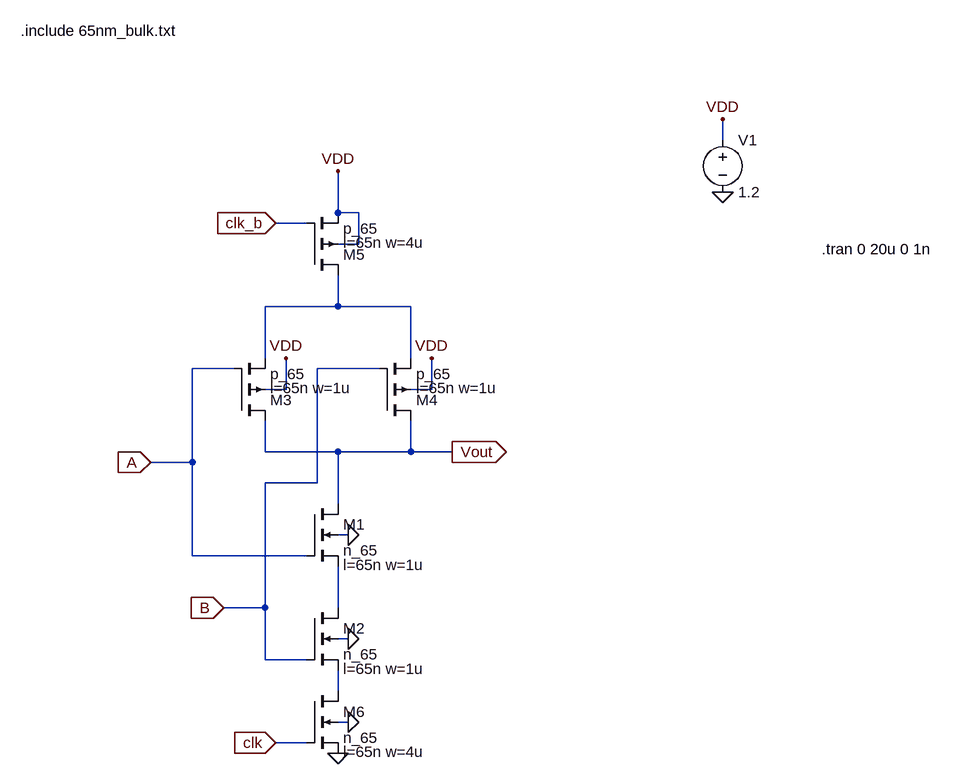
[diagram p0: schematic nand_sym.asc]
nand_sym.asc, the LTspice schematic file:
Version 4
SHEET 1 1728 992
WIRE 592 -240 592 -272
WIRE 0 -128 0 -192
WIRE 32 -128 0 -128
WIRE -48 -112 -96 -112
WIRE 32 -80 32 -128
WIRE 32 -80 0 -80
WIRE 0 16 0 -32
WIRE 0 16 -112 16
WIRE 112 16 0 16
WIRE -112 96 -112 16
WIRE 112 96 112 16
WIRE -160 112 -224 112
WIRE 64 112 -32 112
WIRE -80 144 -80 96
WIRE -80 144 -112 144
WIRE 144 144 144 96
WIRE 144 144 112 144
WIRE -112 240 -112 192
WIRE 0 240 -112 240
WIRE 112 240 112 192
WIRE 112 240 0 240
WIRE 176 240 112 240
WIRE -224 256 -224 112
WIRE -224 256 -288 256
WIRE -32 288 -32 112
WIRE -32 288 -112 288
WIRE 0 320 0 240
WIRE 16 368 0 368
WIRE -224 400 -224 256
WIRE -48 400 -224 400
WIRE -112 480 -112 288
WIRE -112 480 -176 480
WIRE 0 480 0 416
WIRE 16 528 0 528
WIRE -112 560 -112 480
WIRE -48 560 -112 560
WIRE 0 608 0 576
WIRE 16 656 0 656
WIRE -48 688 -96 688
FLAG 0 -192 VDD
FLAG 16 368 0
FLAG 16 528 0
FLAG -288 256 A
IOPIN -288 256 In
FLAG -176 480 B
IOPIN -176 480 In
FLAG -80 96 VDD
FLAG 144 96 VDD
FLAG 16 656 0
FLAG 0 704 0
FLAG -96 -112 clk_b
IOPIN -96 -112 In
FLAG -96 688 clk
IOPIN -96 688 In
FLAG 176 240 Vout
IOPIN 176 240 Out
FLAG 592 -272 VDD
FLAG 592 -160 0
SYMBOL nmos4 -48 320 R0
WINDOW 123 56 94 Left 2
SYMATTR Value2 l=65n w=1u
SYMATTR InstName M1
SYMATTR Value n_65
SYMBOL nmos4 -48 480 R0
WINDOW 123 56 94 Left 2
SYMATTR Value2 l=65n w=1u
SYMATTR InstName M2
SYMATTR Value n_65
SYMBOL pmos4 -160 192 M180
WINDOW 123 56 50 Left 2
SYMATTR Value2 l=65n w=1u
SYMATTR InstName M3
SYMATTR Value p_65
SYMBOL pmos4 64 192 M180
WINDOW 123 56 50 Left 2
SYMATTR Value2 l=65n w=1u
SYMATTR InstName M4
SYMATTR Value p_65
SYMBOL pmos4 -48 -32 M180
WINDOW 123 56 50 Left 2
SYMATTR Value2 l=65n w=4u
SYMATTR InstName M5
SYMATTR Value p_65
SYMBOL nmos4 -48 608 R0
WINDOW 123 56 94 Left 2
SYMATTR Value2 l=65n w=4u
SYMATTR InstName M6
SYMATTR Value n_65
SYMBOL Voltage 592 -256 R0
SYMATTR InstName V1
SYMATTR Value 1.2
TEXT -488 -408 Left 2 !.include 65nm_bulk.txt
TEXT 744 -72 Left 2 !.tran 0 20u 0 1n

The netlist it stands for:
* nand_sym.asc
M1 Vout A N002 0 n_65 l=65n w=1u
M2 N002 B N003 0 n_65 l=65n w=1u
M3 Vout A N001 VDD p_65 l=65n w=1u
M4 Vout B N001 VDD p_65 l=65n w=1u
M5 N001 clk_b VDD VDD p_65 l=65n w=4u
M6 N003 clk 0 0 n_65 l=65n w=4u
V1 VDD 0 1.2
.model NMOS NMOS
.model PMOS PMOS
.lib standard.mos
.include 65nm_bulk.txt
.tran 0 20u 0 1n
.backanno
.end